# EAGLE design UhOh-v11 (EAGLE 6.1)
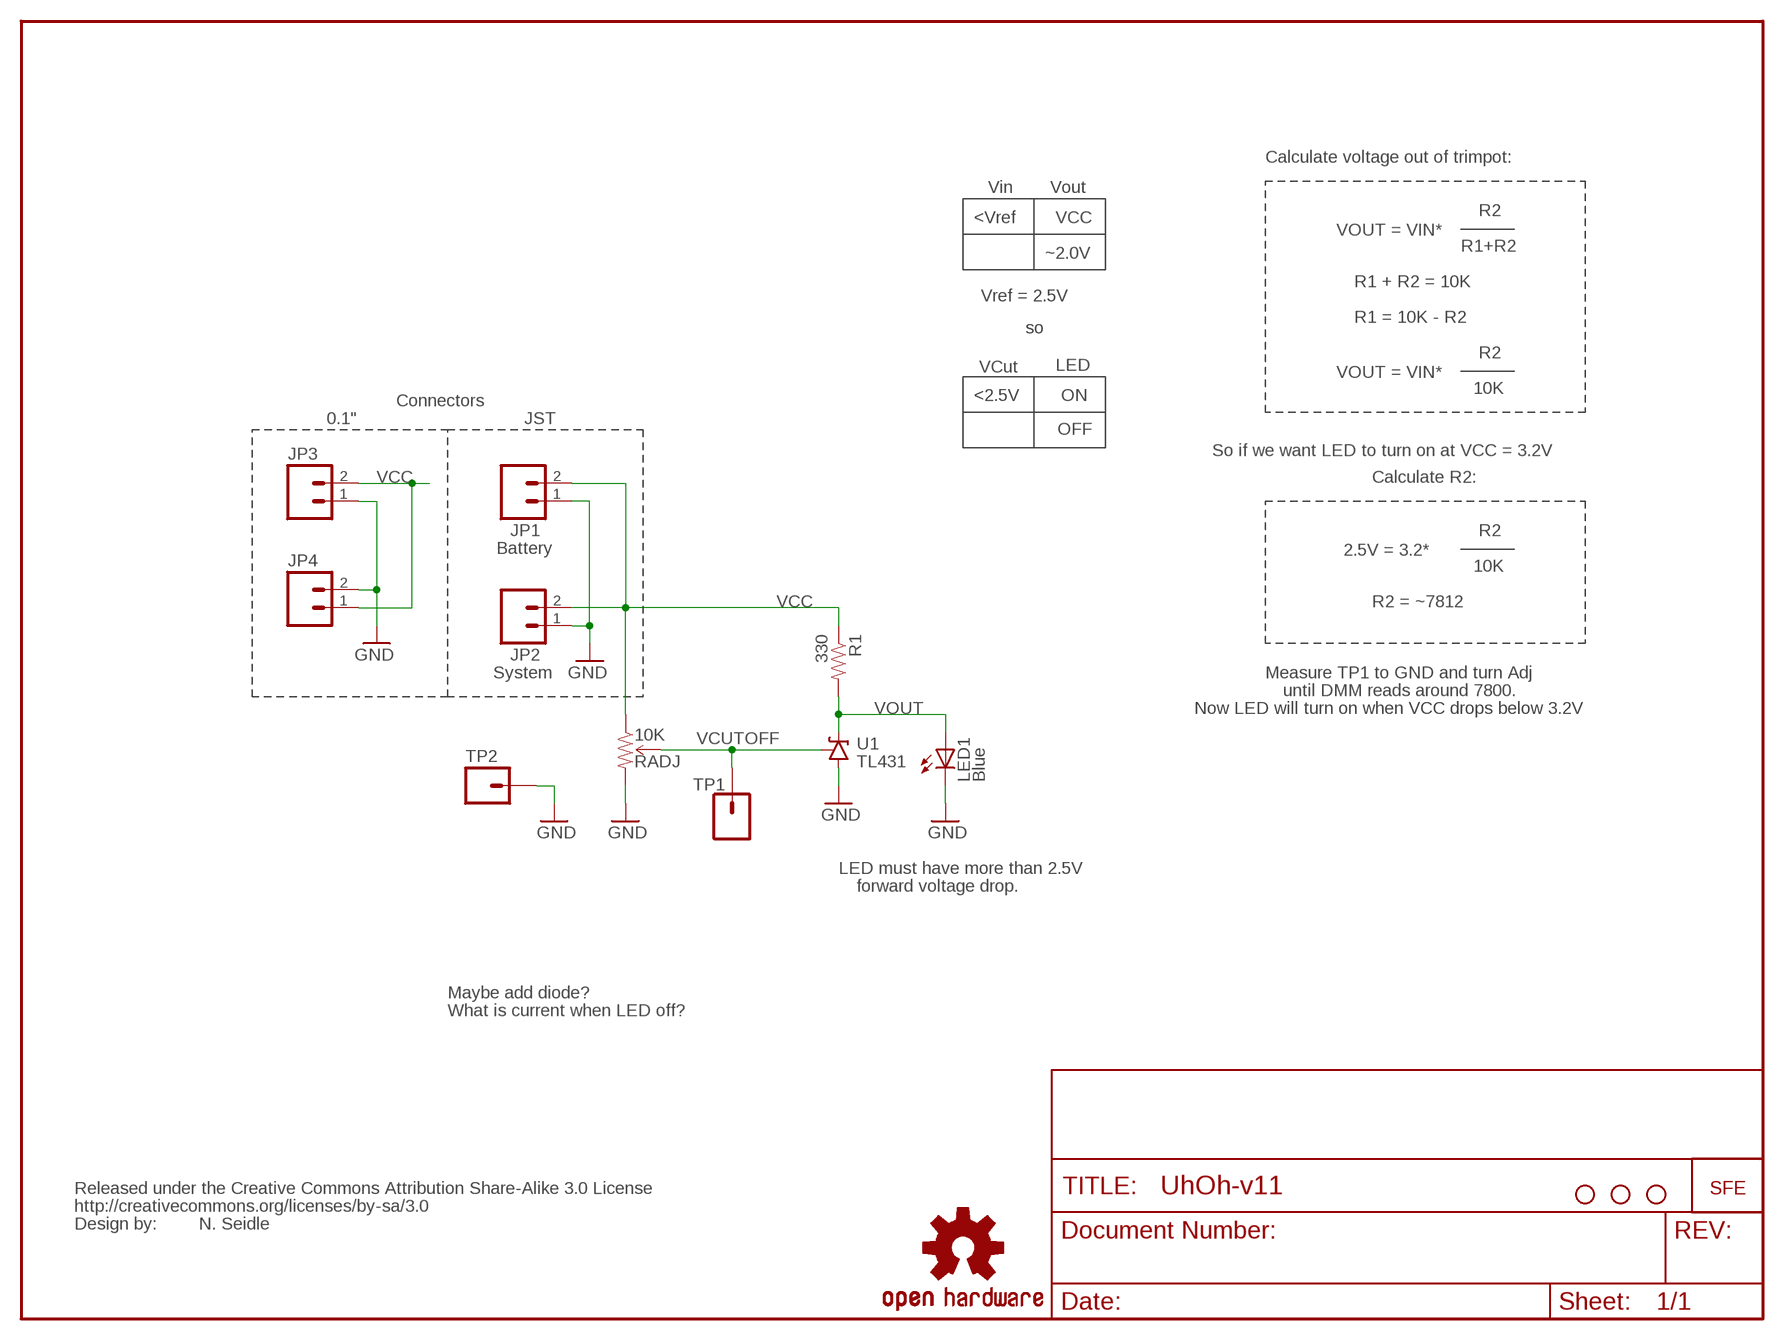
[diagram p0: schematic, sheet 1]

## Parts
JP1  Battery  M02JST-PTH-2  [JST-2-PTH]
JP2  System  M02JST-PTH-2  [JST-2-PTH]
JP3  M02PTH  [1X02]
JP4  M02PTH  [1X02]
JP31  STAND-OFF  [STAND-OFF]
JP41  STAND-OFF  [STAND-OFF]
JP51  LOGO-SFENEW  [SFE-NEW-WEBLOGO]
JP61  STAND-OFF  [STAND-OFF]
LED1  Blue  LED10MM2  [LED10MM-2]
R1  330  RESISTORAXIAL-0.3  [AXIAL-0.3]
RADJ  10K  TRIMPOT-PTH-KNOB  [3386U]
TP1  TP1  M01PTH  [1X01]
TP2  TP2  M01PTH  [1X01]
U1  TL431  TL431PTH  [TO-92]
U$1  OSHW-LOGOS  [OSHW-LOGO-S]
U$2  CREATIVE_COMMONS  [CREATIVE_COMMONS]

## Nets
GND: JP1.1 JP2.1 JP3.1 JP4.2 LED1.K(C) RADJ.3(CW) TP2.1 U1.2(A)
VCC: JP1.2 JP2.2 JP3.2 JP4.1 R1.P$1 RADJ.1(CCW)
VCUTOFF: RADJ.2(WIPER) TP1.1 U1.1(R)
VOUT: LED1.A R1.P$2 U1.3(C)

## Notes on the sheet
- Calculate voltage out of trimpot:
- Vin | Vout
- R2
- <Vref | VCC
- VOUT = VIN*
- R1+R2
- ~2.0V
- R1 + R2 = 10K
- Vref = 2.5V
- R1 = 10K - R2
- so
- R2
- VCut | LED
- VOUT = VIN*
- 10K
- <2.5V | ON
- Connectors
- 0.1" | JST
- OFF
- So if we want LED to turn on at VCC = 3.2V
- Calculate R2:
- R2
- 2.5V = 3.2*
- 10K
- R2 = ~7812
- Measure TP1 to GND and turn Adj
- until DMM reads around 7800.
- Now LED will turn on when VCC drops below 3.2V
- LED must have more than 2.5V
- forward voltage drop.
- Maybe add diode?
- What is current when LED off?
- N. Seidle

## Library data of the parts
JP1-JP4 = SparkFun:M02: Header 2 Standard 2-pin 0.1" header. Use with straight break away headers (SKU : PRT-00116), right angle break away headers (PRT-00553), swiss pins (PRT-00743), machine pins (PRT-00117), and female headers (PRT-00115). Molex polarized connector foot print use with SKU : PRT-08233 with associated crimp pins and housings.
JP31 JP41 JP61 = SparkFun:STAND-OFF: Stand Off This is the mechanical footprint for a #4 phillips button head screw. Use the keepout ring to avoid running the screw head into surrounding components. SKU : PRT-00447
JP51 = SparkFun:LOGO-SFE: Spark Fun Electronics PCB Logo This is the standard Spark Fun Electronics PCB logo.
LED1 = SparkFun:LED: LEDs Standard schematic elements and footprints for 5mm, 3mm, 1206, and 0603 sized LEDs. 5mm - Spark Fun Electronics SKU : COM-00529 (and others)
R1 = SparkFun:RESISTOR: Resistor Basic schematic elements and footprints for 0603, 1206, and PTH resistors.
RADJ = SparkFun:TRIMPOT
TP1 TP2 = SparkFun:M01: Header 1 Standard 1-pin 0.1" header. Use with straight break away headers (SKU : PRT-00116), right angle break away headers (PRT-00553), swiss pins (PRT-00743), machine pins (PRT-00117), and female headers (PRT-00115).
U1 = SparkFun:TL431
U$1 = SparkFun:OSHW-LOGO: Open Source Hardware Logo This logo indicates the piece of hardware it is found on incorporates a OSHW license and/or adheres to the definition of open source hardware found here: http://freedomdefined.org/OSHW
U$2 = SparkFun:CREATIVE_COMMONS

## Board
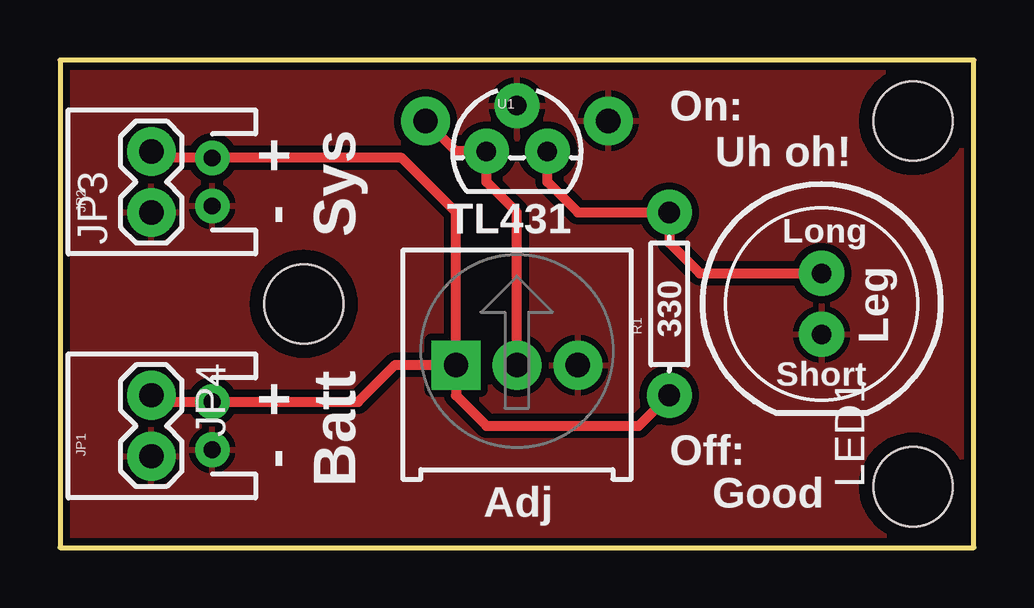
[diagram p1: board, top side]
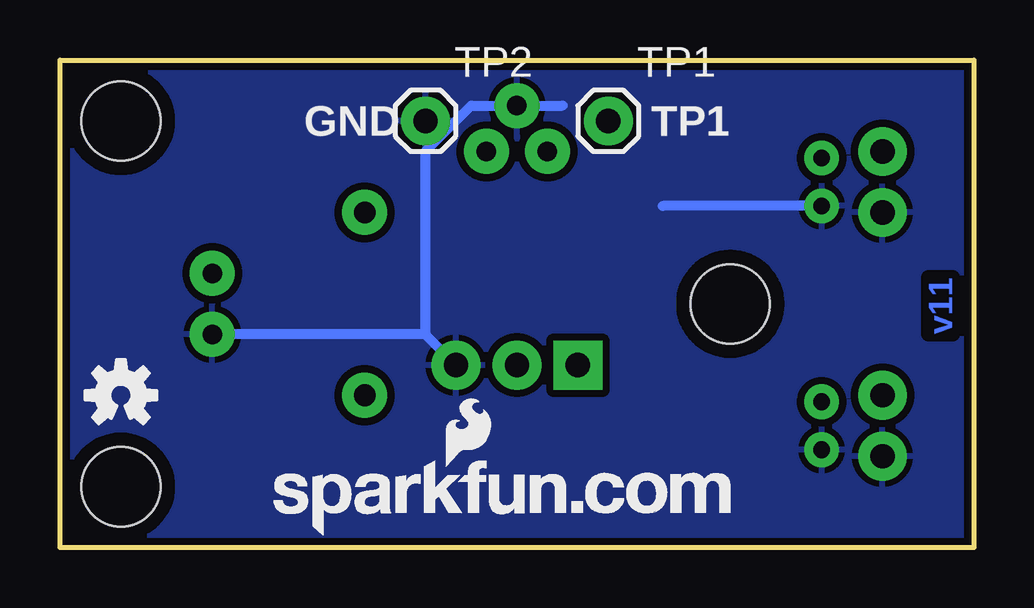
[diagram p2: board, bottom side, seen from below]

Size 38.1 x 20.32 mm. Coordinates in mm from the lower left corner, seen from the top.
Outline: 38.1,0 38.1,20.32 0,20.32 0,0 38.1,0
Copper layers (1*16): Top 0.035mm / dielectric 1.5mm / Bottom 0.035mm
Design rules: minimum track width 8mil, minimum drill 20mil, track to track 8mil, track to pad 8mil, pad to pad 8mil, via to via 8mil, smd to smd 6mil, copper to edge 8mil, drill to drill 8mil, minimum pad ring 12mil, minimum via ring 10mil, stop-mask expansion 4mil, vias tented up to drill 25mil, thermal gap 10mil

### Footprints (pad centres in the part's own frame; a part is rotated, then mirrored left to right if it is on the bottom)
JST-2-PTH = drill 0.7 pad 1.448: 1 -1,0; 2 1,0
1X02 = drill 1.016 pad 1.88: 1 0,0; 2 2.54,0
STAND-OFF = hole 3.302: 0,0
LED10MM-2 = drill 0.813 pad 1.88: A -1.27,0; K 1.27,0
AXIAL-0.3 = drill 0.9 pad 1.88: P$1 -3.81,0; P$2 3.81,0
3386U = drill 1.016 pad 1.88 square: 1 -2.54,-0.015 | drill 1.016 pad 1.88: 2 0,-0.015; 3 2.54,-0.015
1X01 = drill 1.016 pad 1.88: 1 0,0
TO-92 = drill 0.813 pad 1.88: 1 -1.27,0; 2 0,1.905; 3 1.27,0

### Placement (x,y rotation side)
JP1  6.35,5.08 90 top
JP2  6.35,15.24 90 top
JP3  3.81,13.97 90 top
JP4  3.81,6.35 270 top
JP31  35.56,17.78 0 top
JP41  35.56,2.54 0 top
JP51  29.21,0.51 0 bottom
JP61  10.16,10.16 0 top
LED1  31.75,10.16 270 top
R1  25.4,10.16 90 top
RADJ  19.05,7.62 0 top
TP1  15.24,17.78 0 bottom
TP2  22.86,17.78 0 bottom
U1  19.05,16.51 0 top
U$1  35.56,6.35 0 bottom
U$2  12.7,-26.67 0 top  (outside the outline)

### Tracks (layer width: path | path; a pad name or v marks a point on that pad's centre or on a via)
GND
  Bottom 0.406: JP2.1 12.97,14.24 | 17.14,18.41 U1.2 20.95,18.41 22.86,16.51 22.86,8.9 22.88,8.89 | 22.88,8.89 LED1.K | RADJ.3 22.88,8.89
  pour Bottom (isolate 0.305): 0,0 0,20.32 38.1,20.32 38.1,0
  pour Top (isolate 0.305): 0,20.32 38.1,20.32 38.1,0 0,0
VCC
  Top 0.406: RADJ.1 16.51,13.97 14.24,16.24 JP2.2 4.08,16.24 JP3.2 | RADJ.1 16.5,7.62 13.97,7.62 12.43,6.08 JP1.2 4.08,6.08 JP4.1 | RADJ.1 16.51,6.35 17.78,5.08 24.13,5.08 R1.P$1
VCUTOFF
  Top 0.406: RADJ.2 19.05,13.97 17.78,15.24 U1.1 16.51,16.51 TP1.1
VOUT
  Top 0.406: LED1.A 26.67,11.43 25.4,12.7 R1.P$2 21.59,13.97 20.32,15.24 U1.3

### Text on the board
Bottom: v11
tPlace: On: | + | Uh oh! | - | Sys | Long | Leg | Short | + | - | Batt | Off: | Good | Adj
bPlace: TP1 | GND